# EAGLE schematic Tea_stirrer (EAGLE 7.3.0)
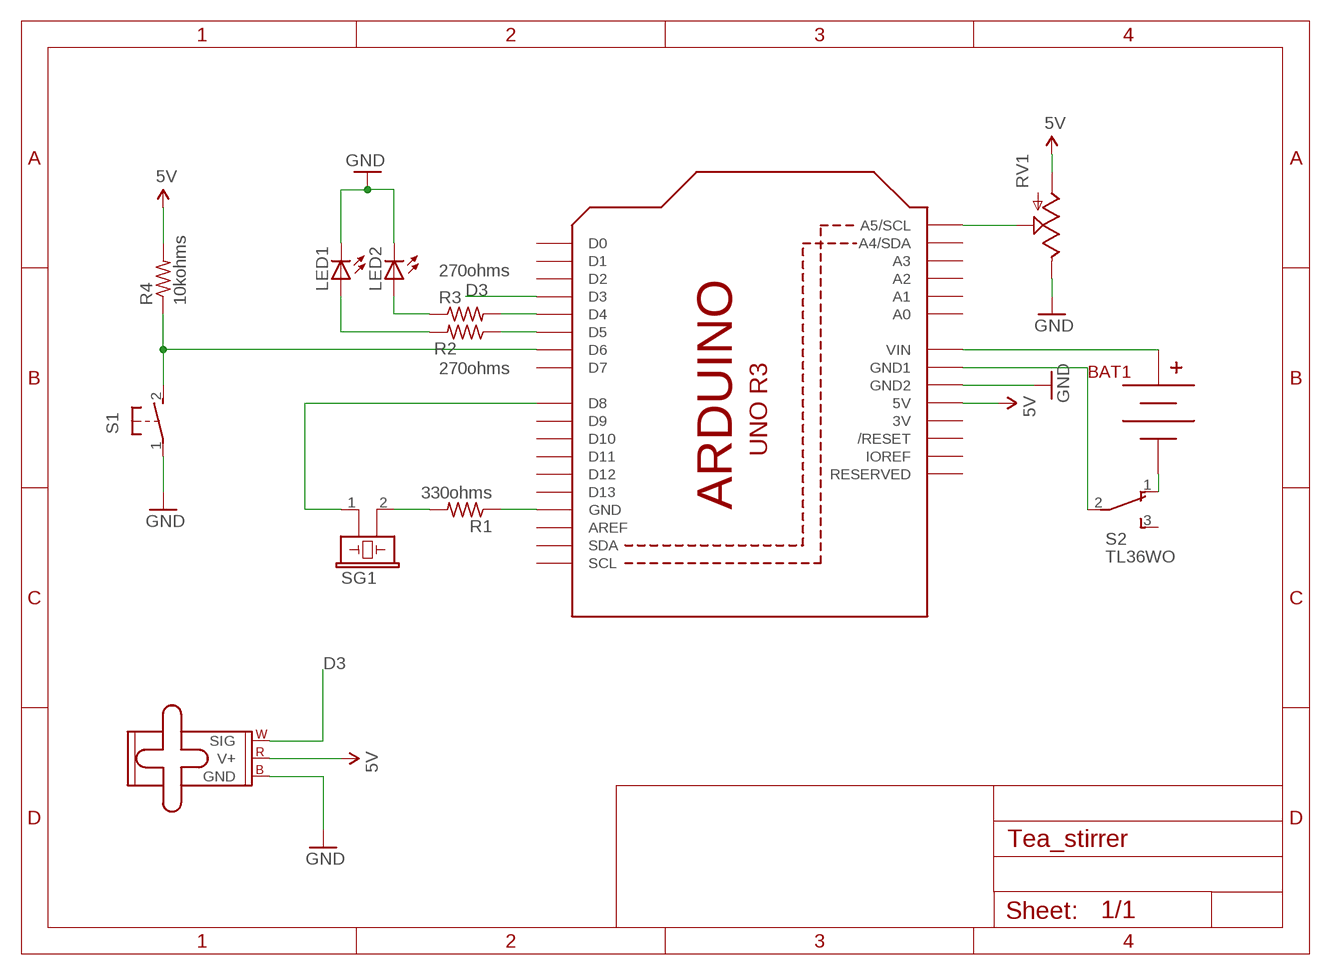
[diagram p0: schematic, sheet 1]

## Parts
BAT1  BC9VPC  [BC9VPC]
LED1  LED5MM  [LED5MM]
LED2  LED5MM  [LED5MM]
M1  SMALL_SERVO  [1X03]
R1  330ohms  FLIPFLOP-RES  [0805-THM]
R2  270ohms  FLIPFLOP-RES  [0805-THM]
R3  270ohms  FLIPFLOP-RES  [0805-THM]
R4  10kohms  FLIPFLOP-RES  [0805-THM]
RV1  POT  [ALPS_POT]
S1  31-XX  [B3F-31XX]
S2  TL36WO  [TL3XWO]
SG1  EFBAA40D101  [EFBAA40D101]
U2  ARDUINOR3-BPLACE  [ARDUINOR3-BPLACE]

## Nets
5V: M1.2(V+) R4.2 RV1.P$3(A) U2.5V
D3: M1.1(SIG) U2.D3
GND: LED1.K(C) LED2.K(C) M1.3(GND) RV1.P$1(E) S1.1(P) U2.GND2
N$1: R3.2 U2.D4
N$2: R2.1 U2.D5
N$3: LED2.A R3.1
N$4: LED1.A R2.2
N$5: R1.1 U2.GND
N$6: R1.2 SG1.2
N$7: SG1.1 U2.D8
N$8: BAT1.V+ U2.VIN
N$9: BAT1.V- S2.1(O)
N$10: S2.2(P) U2.GND1
N$11: RV1.P$2(S) U2.A5(A5/SCL)
N$12: R4.1 S1.2(S) U2.D6
Unconnected: S2.3(S) U2.A0 U2.A1 U2.A2 U2.A3 U2.A4(A4/SDA) U2.AREF U2.D0 U2.D1 U2.D2 U2.D7 U2.D9 U2.D10 U2.D11 U2.D12 U2.D13 U2.IOREF U2.RESERVED U2.RESET(/RESET) U2.SCL U2.SDA

## Power pins joined to a net without a drawn wire
3V: U2.3V

## Library data of the parts
BAT1 = SparkFun-Connectors:BC9VPC: 9V board-mount battery cradle; PROD_ID: BATT-10855
LED1 LED2 = adafruit:LED: LED OSRAM: - CHIPLED LG R971, LG N971, LY N971, LG Q971, LY Q971, LO R971, LY R971 LH N974, LH R974 LS Q976, LO Q976, LY Q976 LO Q996 - Hyper CHIPLED LW Q18S LB Q993, LB Q99A, LB R99A - SideLED LS A670, LO A670, LY A670, LG A670, LP A670 LB A673, LV A673, LT A673, LW A673 LH A674 LY A675 LS A676, LA A676, LO A676, LY A676, LW A676 LS A679, LY A679, LG A679 - Hyper Micro SIDELED® LS Y876, LA Y876, LO Y876, LY Y876 LT Y87S - SmartLED LW L88C, LW L88S LB L89C, LB L89S, LG L890 LS L89K, LO L89K, LY L89K LS L896, LA L896, LO L896, LY L896 - TOPLED LS T670, LO T670, LY T670, LG T670, LP T670 LSG T670, LSP T670, LSY T670, LOP T670, LYG T670 LG T671, LOG T671, LSG T671 LB T673, LV T673, LT T673, LW T673 LH T674 LS T676, LA T676, LO T676, LY T676, LB T676, LH T676, LSB T676, LW T676 LB T67C, LV T67C, LT T67C, LS T67K, LO T67K, LY T67K, LW E67C LS E67B, LA E67B, LO E67B, LY E67B, LB E67C, LV E67C, LT E67C LW T67C LS T679, LY T679, LG T679 LS T770, LO T770, LY T770, LG T770, LP T770 LB T773, LV T773, LT T773, LW T773 LH T774 LS E675, LA E675, LY E675, LS T675 LS T776, LA T776, LO T776, LY T776, LB T776 LHGB T686 LT T68C, LB T68C - Hyper Mini TOPLED® LB M676 - Mini TOPLED Santana® LG M470 LS M47K, LO M47K, LY M47K Source: http://www.osram.convergy.de/
M1 = SparkFun-Electromechanical:SMALL_SERVO: Small servo motor This is the small servo used in the SIK. SKU: ROB-09065
R1-R4 = adafruit:FLIPFLOP-RES: Flip Flop resistor An 0805 resistor inside a standard 1/4W 5% resistor. Makes for easy mods
RV1 = SparkFun-Electromechanical:POT; PROD_ID: RES-09177
S1 = switch-omron:31-XX: OMRON SWITCH; MPN: B3F-3100; OC_FARNELL: 959704; OC_NEWARK: 36M3582
S2 = switch:TL36WO: TINY SWITCH ON - ON Source: http://www2.produktinfo.conrad.com/datenblaetter/700000-724999/705152-da-01-de-Subminiaturschalter_TL_36WO.pdf
SG1 = buzzer:EFB?: Piezoelectric Acoustic Transducer Source: Panbasonic .. 2SC1685.pdf; OC_FARNELL: unknown; OC_NEWARK: unknown
U2 = microbuilder:ARDUINOR3: This is a new object for the new Arduino R3 - with extra pins that you may want to use (such as IOref, and duplicated A4/A5